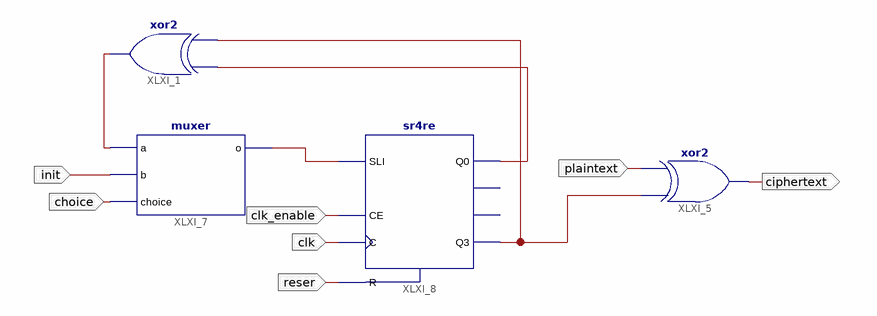
[diagram p0: schematic sheet 1]
// Xilinx ISE schematic lfsr_sch.sch (xc9500) as structural Verilog: 4 symbols, 7 ports
module lfsr_sch (
  input  init,
  input  choice,
  input  clk,
  input  clk_enable,
  input  reser,
  input  plaintext,
  output ciphertext
);

  wire XLXN_9, XLXN_18, XLXN_19, XLXN_20;

  xor XLXI_1 (XLXN_9, XLXN_20, XLXN_19);
  xor XLXI_5 (ciphertext, XLXN_19, plaintext);
  muxer XLXI_7 (.a(XLXN_9), .b(init), .choice(choice), .o(XLXN_18));
  sr4re XLXI_8 (.C(clk), .CE(clk_enable), .R(reser), .SLI(XLXN_18), .Q0(XLXN_20), .Q3(XLXN_19));  // open: Q1, Q2
endmodule
